# Altium schematic sheet [01] COVER PAGE.SchDoc: template
size 292 x 193 mm; Author: Hom; CompanyName: KitSprout; DrawnBy: Hom; Engineer: Hom; Organization: KitSprout; Revision: A; SheetNumber: 1; SheetTotal: 3; LibVersion: v3.6; Version: v1.0A
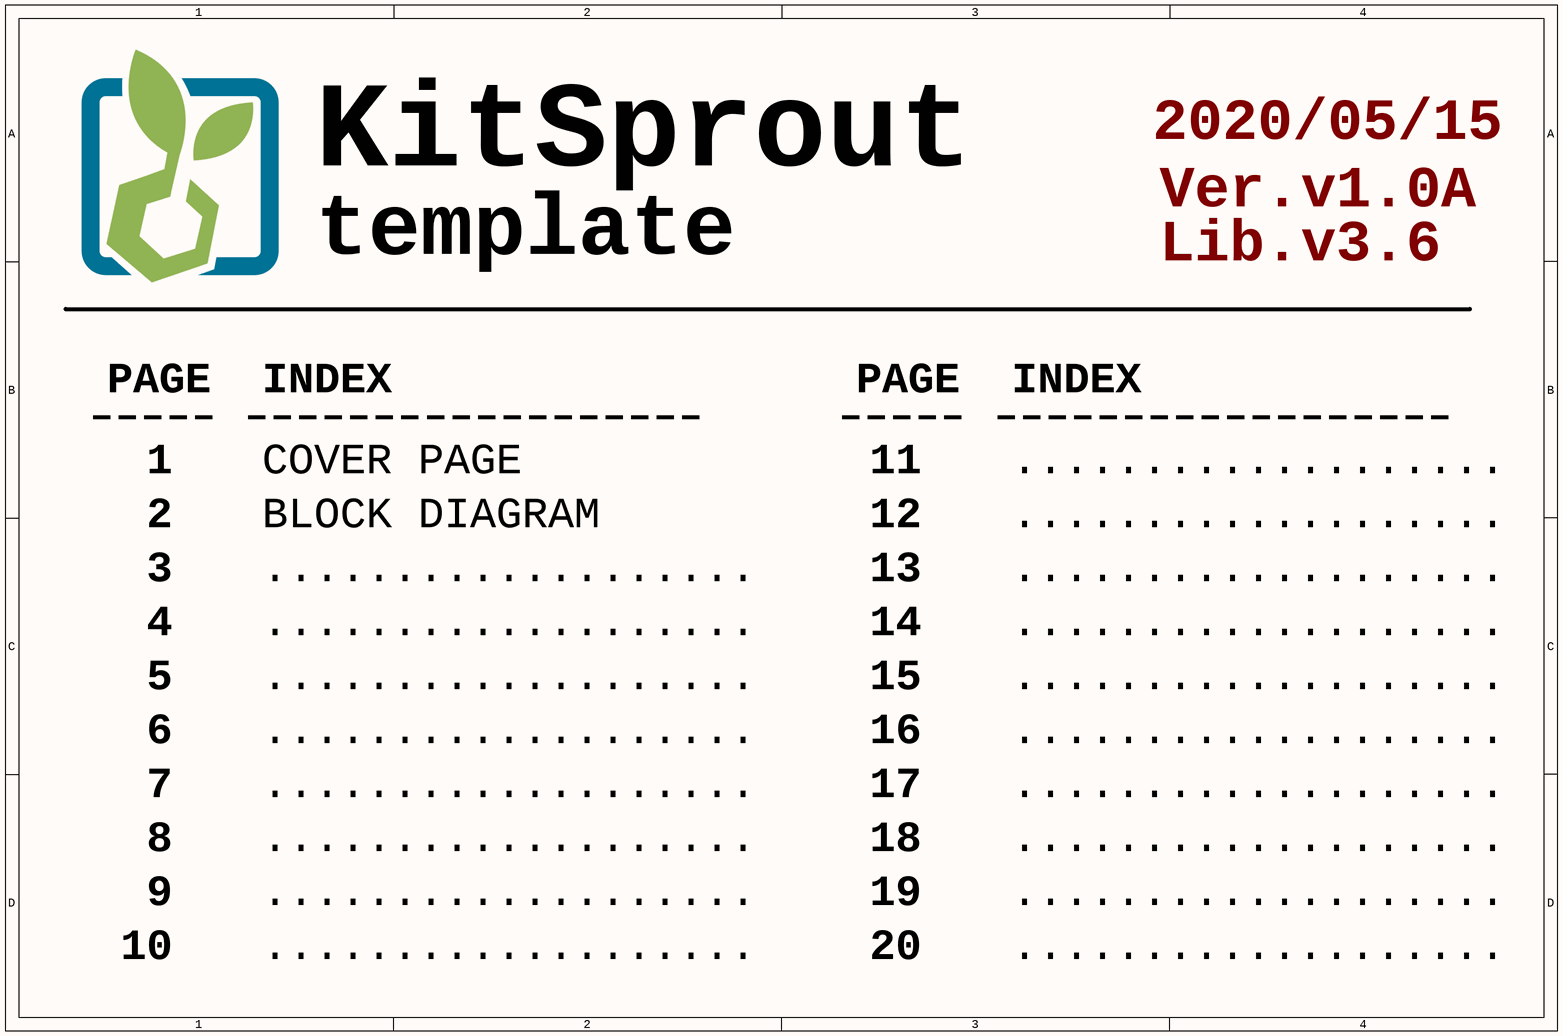
[diagram p0: [01] COVER PAGE.SchDoc]

## Notes on the sheet
- 2020/05/15
- Ver.
- Lib.
- PAGE
- INDEX
- 1
- COVER PAGE
- 11
- ...................
- 2
- BLOCK DIAGRAM
- 12
- 3
- 4
- 13
- 14
- 5
- 15
- 6
- 16
- 7
- 17
- 8
- 9
- 18
- 19
- 10
- 20
- Title
- Size:
- Date:
- A4
- Number:
- Time:
- Revision:
- Sheet
- of
- File: